# Altium schematic sheet EEPROM.SchDoc
size A; SheetNumber: 3; SheetTotal: 12
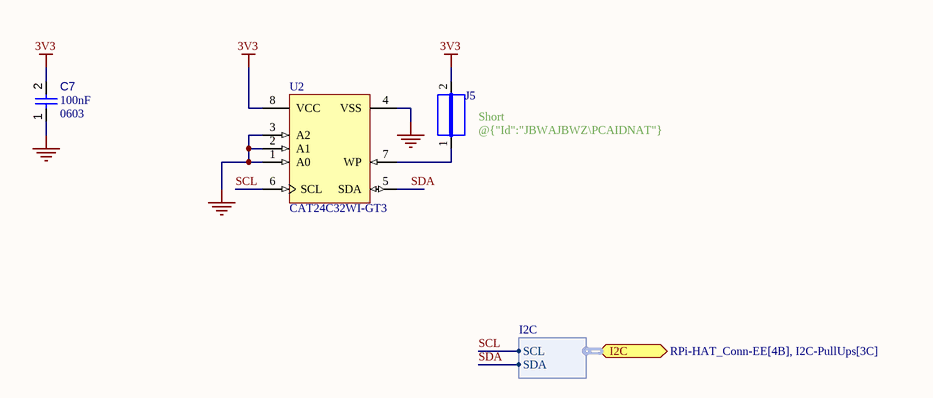
[diagram p0: EEPROM.SchDoc]

## Parts
C7  value 100nF  Case/Package: 0603  [CAPC1608X90X40NL10T20]  (hidden comment: Capacitor 100 nF +/-10% 50 V 0603)
J5  JUMPER  [JUMPER]  (value not drawn)
U2  CAT24C32WI-GT3  [ONSC-SOIC-8-751BD-01_M]

## Ports
I2C (bidir, harness I2C, see RPi-HAT_Conn-EE[4B], I2C-PullUps[3C])

## Harnesses
I2C: SCL, SDA

## Nets
3V3: C7.2 J5.2 U2.8(VCC)
GND: C7.1 U2.1(A0) U2.2(A1) U2.3(A2) U2.4(VSS)
SCL: U2.6(SCL) ; port I2C.SCL
SDA: U2.5(SDA) ; port I2C.SDA
NetJ5_1: J5.1 U2.7(WP)

## Notes on the sheet
- (near J5) Short @{"Id":"JBWAJBWZ\PCAIDNAT"} to enable
  Write Protect

## Library data of the parts
C7 = CMP-001-00017-6: Chip Capacitor, 100 nF, +/- 10%, 50 V, 0603 (1608 Metric); Voltage Rating: 50V; Capacitor Type: Ceramic; Tolerance: 10%; Mounting Technology: SM; Max Operating Temperature: 125°C; RoHS Compliant: True; Pins: 2; Min Operating Temperature: -55°C
J5 = CMP-009-00061-2: Pins: 2
U2 = CMP-019-00003-4: I2C CMOS Serial EEPROM, 32 Kb, 1.7 to 5.5 V, -40 to 85 degC, 8-Pin SOIC (751BD), RoHS, Tape and Reel; Manufacturer: ON Semiconductor; Nominal Supply Current: 2mA; Access Time: 3500ns; Clock Frequency: 100kHz; Density: 32Kb; Max Supply Voltage: 5.5V; Frequency: 400kHz; Min Supply Voltage: 1.7V; Package URL: http://www.onsemi.com/pub_link/Collateral/751BD.PDF; Max Operating Temperature: 85°C; Pins: 8; Min Operating Temperature: -40°C; Datasheet URL: http://www.onsemi.com/pub_link/Collateral/CAT24C32-D.PDF; Manufacturer URL: http://www.onsemi.com/; Interface: Serial; Datasheet Version: Rev. 24, 06/2015; RoHS Compliant: True; Max Clock Frequency: 100KHz; Mounting Technology: SM; Package Description: 8-Pin Small Outline Integrated Circuit, Body 4.9 x 3.9 mm, Pitch 1.27 mm; Case/Package: SOIC; Package Reference: SOIC-8-751BD-01; Packaging: TapeandReel; Package Quantity: 3000